# EAGLE design RPi Color Detector LED PCB v2 (EAGLE 9.1.3)
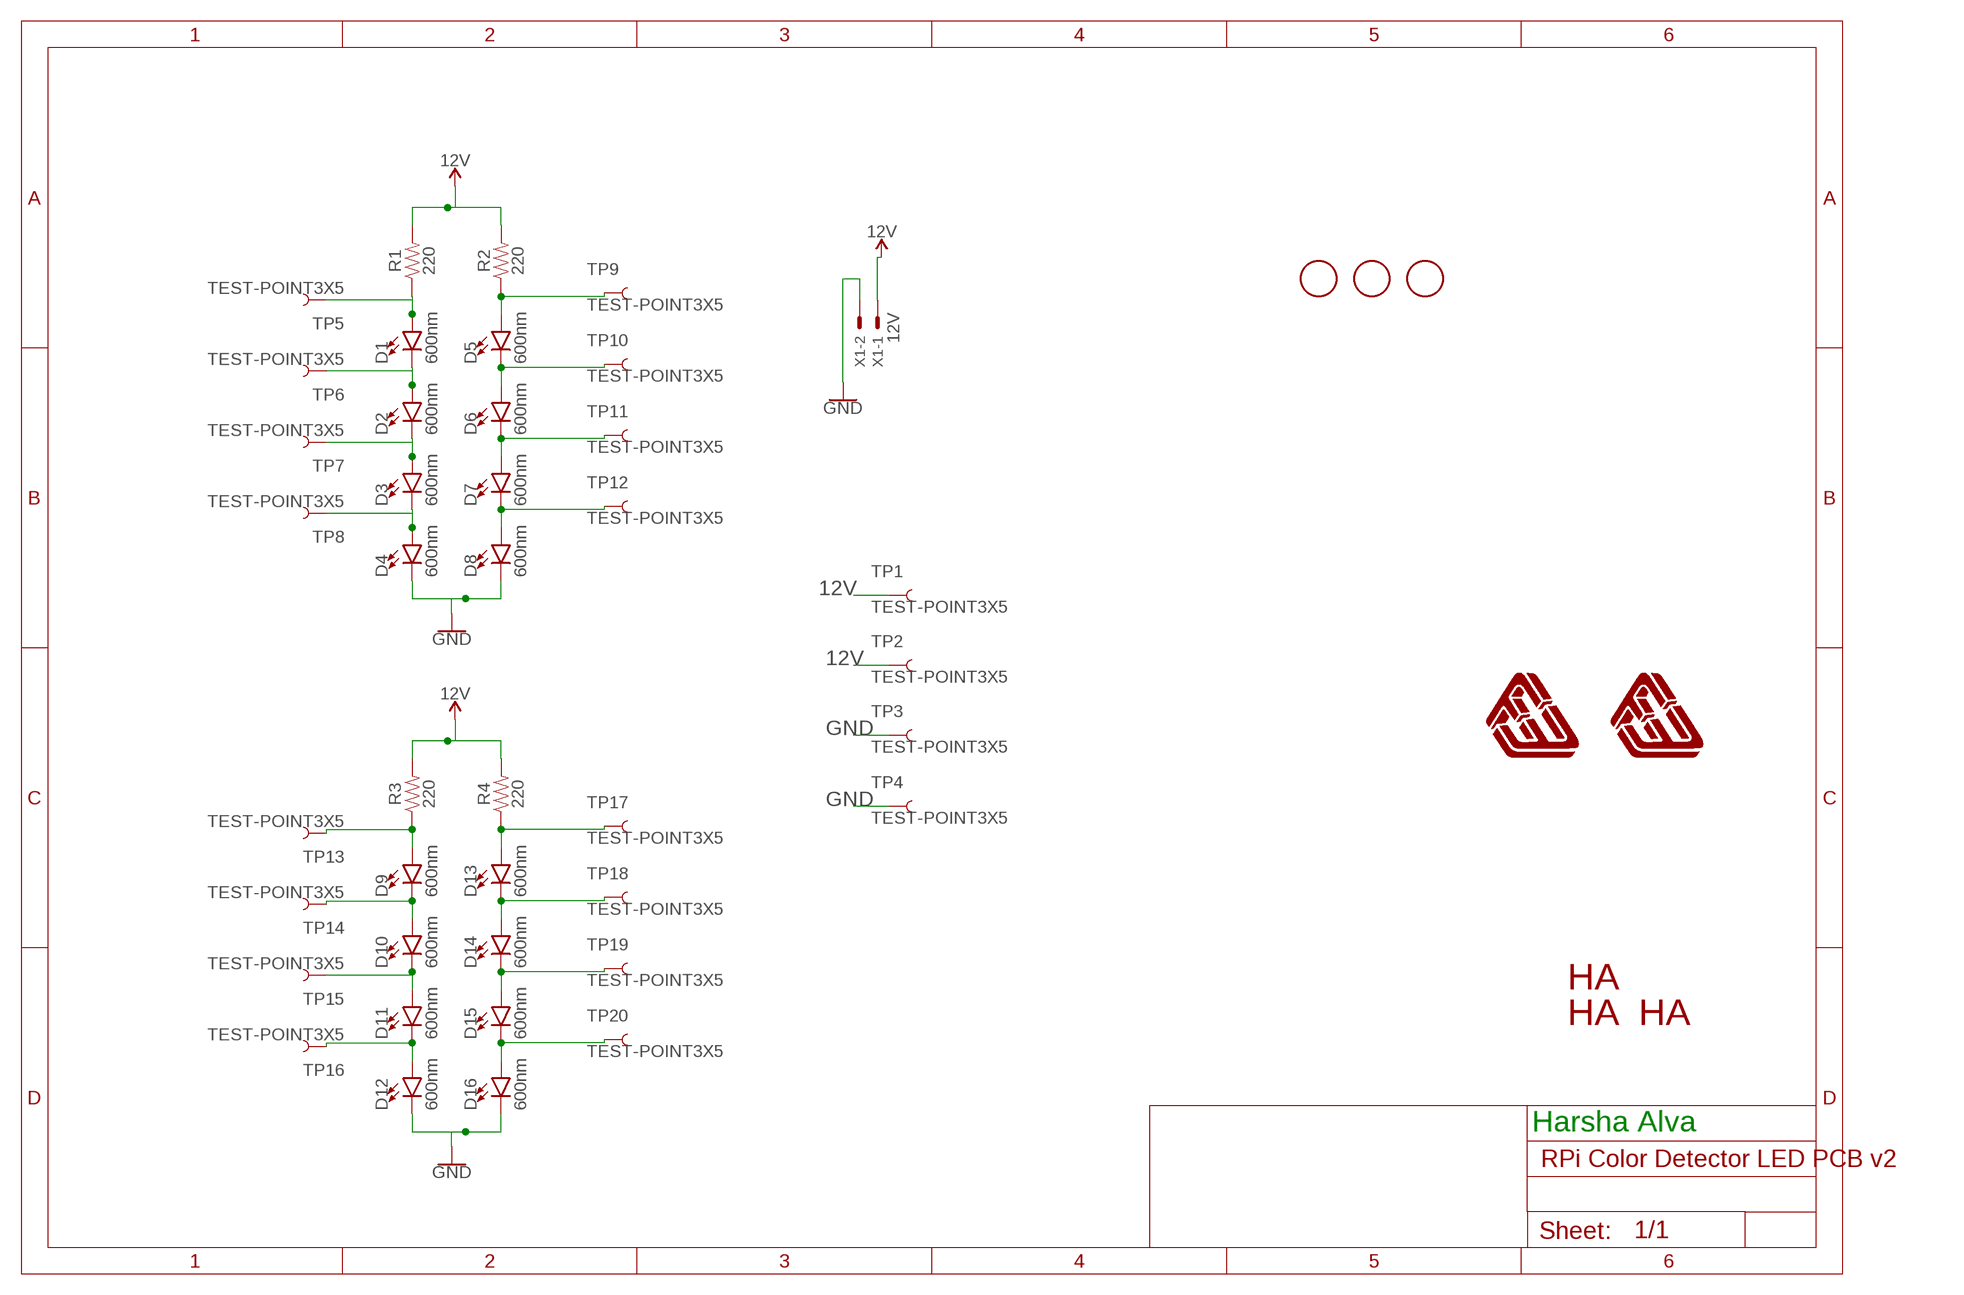
[diagram p0: schematic, sheet 1]

## Parts
D1  600nm  LED-GREEN0603  [LED-0603]
D2  600nm  LED-GREEN0603  [LED-0603]
D3  600nm  LED-GREEN0603  [LED-0603]
D4  600nm  LED-GREEN0603  [LED-0603]
D5  600nm  LED-GREEN0603  [LED-0603]
D6  600nm  LED-GREEN0603  [LED-0603]
D7  600nm  LED-GREEN0603  [LED-0603]
D8  600nm  LED-GREEN0603  [LED-0603]
D9  600nm  LED-GREEN0603  [LED-0603]
D10  600nm  LED-GREEN0603  [LED-0603]
D11  600nm  LED-GREEN0603  [LED-0603]
D12  600nm  LED-GREEN0603  [LED-0603]
D13  600nm  LED-GREEN0603  [LED-0603]
D14  600nm  LED-GREEN0603  [LED-0603]
D15  600nm  LED-GREEN0603  [LED-0603]
D16  600nm  LED-GREEN0603  [LED-0603]
FWLOGO_1  FWLOGO  [FWLOGO]
FWLOGO_2  FWLOGO  [FWLOGO]
M_HA_1  HA_MARK  [HA_MARK]
M_HA_3  HA_MARK  [HA_MARK]
M_HA_4  HA_MARK  [HA_MARK]
R1  220  220OHM-0603-1/10W-1%  [0603]
R2  220  220OHM-0603-1/10W-1%  [0603]
R3  220  220OHM-0603-1/10W-1%  [0603]
R4  220  220OHM-0603-1/10W-1%  [0603]
TP1  TEST-POINT3X5  [PAD.03X.05]
TP2  TEST-POINT3X5  [PAD.03X.05]
TP3  TEST-POINT3X5  [PAD.03X.05]
TP4  TEST-POINT3X5  [PAD.03X.05]
TP5  TEST-POINT3X5  [PAD.03X.05]
TP6  TEST-POINT3X5  [PAD.03X.05]
TP7  TEST-POINT3X5  [PAD.03X.05]
TP8  TEST-POINT3X5  [PAD.03X.05]
TP9  TEST-POINT3X5  [PAD.03X.05]
TP10  TEST-POINT3X5  [PAD.03X.05]
TP11  TEST-POINT3X5  [PAD.03X.05]
TP12  TEST-POINT3X5  [PAD.03X.05]
TP13  TEST-POINT3X5  [PAD.03X.05]
TP14  TEST-POINT3X5  [PAD.03X.05]
TP15  TEST-POINT3X5  [PAD.03X.05]
TP16  TEST-POINT3X5  [PAD.03X.05]
TP17  TEST-POINT3X5  [PAD.03X.05]
TP18  TEST-POINT3X5  [PAD.03X.05]
TP19  TEST-POINT3X5  [PAD.03X.05]
TP20  TEST-POINT3X5  [PAD.03X.05]
U$1  FIDUCIAL  [FIDUCIAL_1MM]
U$2  FIDUCIAL  [FIDUCIAL_1MM]
U$3  FIDUCIAL  [FIDUCIAL_1MM]
X1  12V  JST-XH-02-PIN-LONG-PAD  [JST-XH-02-PACKAGE-LONG-PAD]

## Nets
12V: R1.2 R2.2 R3.2 R4.2 TP1.P$1 TP2.P$1 X1.1
GND: D4.C D8.C D12.C D16.C TP3.P$1 TP4.P$1 X1.2
N$1: D1.A R1.1 TP5.P$1
N$4: D1.C D2.A TP6.P$1
N$5: D2.C D3.A TP7.P$1
N$6: D3.C D4.A TP8.P$1
N$7: D5.A R2.1 TP9.P$1
N$8: D5.C D6.A TP10.P$1
N$9: D6.C D7.A TP11.P$1
N$10: D7.C D8.A TP12.P$1
N$11: D9.A R3.1 TP13.P$1
N$12: D9.C D10.A TP14.P$1
N$13: D10.C D11.A TP15.P$1
N$14: D11.C D12.A TP16.P$1
N$15: D13.A R4.1 TP17.P$1
N$16: D13.C D14.A TP18.P$1
N$17: D14.C D15.A TP19.P$1
N$18: D15.C D16.A TP20.P$1

## Notes on the sheet
- Harsha Alva

## Library data of the parts
D1-D16 = SparkFun-LED:LED-GREEN: Green SMD LED Used in manufacturing of various products at SparkFun Packages: 0603 - SMD 0603 package [Product Link] <http://www.futureelectronics.com/en/technologies/semiconductors/optoelectronics/leds/Pages/9894312-LTST-C190GKT.aspx?CrossPart=HSMG-C190&IM=0> LilyPad 1206 - SMD1206 LilyPad package [Product Link] <http://www.futureelectronics.com/en/Technologies/Product.aspx?ProductID=IN150NGHARVATEKCORPORATION2049943&IM=0> 1206 - SMD1206 package [Product Link] <http://www.futureelectronics.com/en/technologies/semiconductors/optoelectronics/leds/Pages/8315665-LTST-C150KGKT.aspx?IM=0> 1206 Bottom Mount -SMD 1206 Bottom Mount [Product Link] <http://www.digikey.com/product-detail/en/lite-on-inc/LTST-C230KGKT/160-1456-1-ND/386854> SparkFun Products: Pro Mini 328 -5V <https://www.sparkfun.com/products/821> RedBoard <https://www.sparkfun.com/products/12757> MP3 Trigger <https://www.sparkfun.com/products/13720> Makey Makey <https://www.sparkfun.com/products/11076>; PROD_ID: DIO-00821; VALUE: GREEN
FWLOGO_1 FWLOGO_2 = FracktalWorks:FWLOGO: Fracktal Works Logo without name
M_HA_1 M_HA_3 M_HA_4 = FracktalWorks:HA_MARK: Maker mark
R1-R4 = SparkFun-Resistors:220OHM: 220Ω resistor A resistor is a passive two-terminal electrical component that implements electrical resistance as a circuit element. Resistors act to reduce current flow, and, at the same time, act to lower voltage levels within circuits. - Wikipedia; PROD_ID: RES-07861
TP1-TP20 = SparkFun-Connectors:TEST-POINT: SparkFun Test Points Bare copper test points for troubleshooting or In-Circuit-Testing. These are used by our Production team for verifying production board runs using pogo-pins on test beds. SparkFun Products: SparkFun LSM9DS1 Breakout <https://www.sparkfun.com/products/13284> SparkFun PSOC <https://www.sparkfun.com/products/13714> SparkFun Load Cell Amplifier <https://www.sparkfun.com/products/13879>
U$1-U$3 = adafruit:FIDUCIAL: For use by pick and place machines to calibrate the vision/machine, 1mm By microbuilder.eu
X1 = Rembrandt Electronics - JST XH Connectors v1-0:JST-XH-02-PIN: JST XH Connector 2 Pin Wire to board connector. Pitch: 2,54 mm, (0.100") Number of pins: 2 Created by Rembrandt Electronics www.rembrandtelectronics.com

## Board
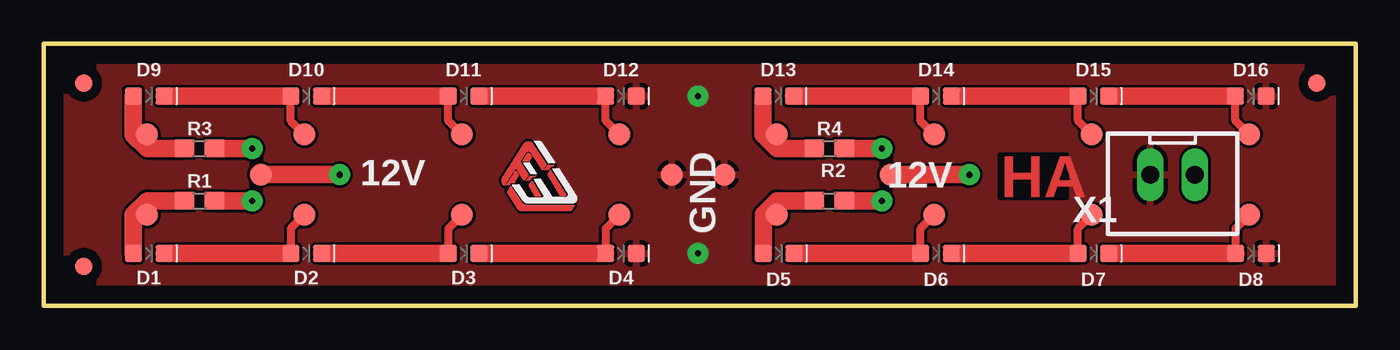
[diagram p1: board, top side]
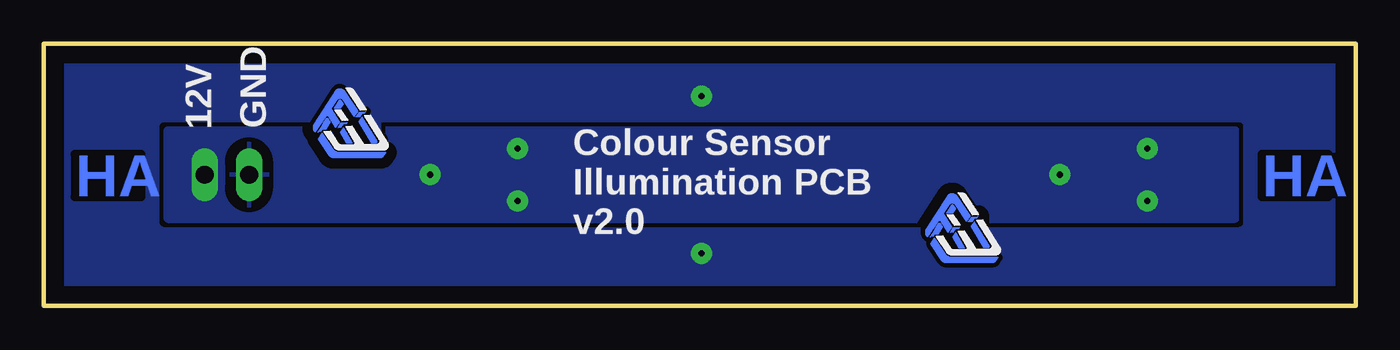
[diagram p2: board, bottom side, seen from below]

Size 75 x 15 mm. Coordinates in mm from the lower left corner, seen from the top.
Outline: 75,15 75,0 0,0 0,15 75,15
Copper layers (1*16): Top 0.035mm / dielectric 1.5mm / Bottom 0.035mm
Design rules "default": minimum track width 6mil, minimum drill 0.35mm, track to track 6mil, track to pad 6mil, pad to pad 6mil, via to via 6mil, smd to smd 6mil, copper to edge 40mil, drill to drill 6mil, minimum pad ring 10mil, minimum via ring 8mil, stop-mask expansion 4mil, vias tented up to drill 0mil, thermal gap 10mil

### Footprints (pad centres in the part's own frame; a part is rotated, then mirrored left to right if it is on the bottom)
LED-0603 = smd 1 x 1: A -0.877,0; C 0.877,0
0603 = smd 1.1 x 1: 1 -0.85,0; 2 0.85,0
PAD.03X.05 = smd 1.27 x 1.27: P$1 0,0
FIDUCIAL_1MM = smd 1 x 1: 1 0,0
JST-XH-02-PACKAGE-LONG-PAD = drill 1.016 long: 1 -1.27,0; 2 1.27,0

### Placement (x,y rotation side)
D1  6,3 0 top
D2  15,3 0 top
D3  24,3 0 top
D4  33,3 0 top
D5  42.01,3 0 top
D6  51,3 0 top
D7  60,3 0 top
D8  69.01,3 0 top
D9  6,12 0 top
D10  15,12 0 top
D11  24,12 0 top
D12  33,12 0 top
D13  41.99,12 0 top
D14  51,12 0 top
D15  60,12 0 top
D16  69,12 0 top
FWLOGO_1  24.68,4.28 0 top
FWLOGO_2  61.1,7.32 0 bottom
FWLOGO_4  FWLOGO  [FWLOGO]  26.1,1.32 0 bottom
FWLOGO_5  FWLOGO  [FWLOGO]  26.1,1.32 0 bottom
M_HA_1  54.7,6.21 0 top
M_HA_3  5.36,6.25 0 bottom
M_HA_4  73.2,6.25 0 bottom
R1  8.91,6 0 top
R2  44.91,6 0 top
R3  8.91,9 0 top
R4  44.91,9 0 top
TP1  12.41,7.5 0 top
TP2  48.41,7.5 0 top
TP3  35.91,7.5 0 top
TP4  38.91,7.5 0 top
TP5  5.91,5.2 0 top
TP6  14.91,5.2 0 top
TP7  23.91,5.2 0 top
TP8  32.91,5.2 0 top
TP9  41.91,5.2 0 top
TP10  50.91,5.2 0 top
TP11  59.91,5.2 0 top
TP12  68.91,5.2 0 top
TP13  5.91,9.8 0 top
TP14  14.91,9.8 0 top
TP15  23.91,9.8 0 top
TP16  32.91,9.8 0 top
TP17  41.91,9.8 0 top
TP18  50.91,9.8 0 top
TP19  59.91,9.8 0 top
TP20  68.91,9.8 0 top
U$1  2.28,12.75 0 top
U$2  2.28,2.25 0 top
U$3  72.78,12.75 0 top
X1  64.53,7.5 180 top

### Tracks (layer width: path | path; a pad name or v marks a point on that pad's centre or on a via)
12V  (via drill 0.35 pad 1.2)
  Top 1: R3.2 v11.91,9 | R1.2 v11.91,6 | TP1.P$1 v16.91,7.5 | R4.2 v47.91,9 | R2.2 v47.91,6 | TP2.P$1 v52.91,7.5
  pour Bottom (isolate 0.61, no thermals): 6.91,10 67.91,10 67.91,5 6.91,5
GND  (via drill 0.35 pad 1.2)
  other vias: 37.41,3 37.41,12
  pour Top: -0.63,15.86 76.3,15.86 76.3,-1.27 -0.63,-1.27
  pour Bottom (isolate 0.254, rank 2): -2.09,17 76.91,17 76.91,-2 -2.09,-2
N$1
  Top 1: D1.A 5.13,5.22 | 5.13,5.22 5.91,6 R1.1 | TP5.P$1 5.89,5.22 5.13,5.22
N$4
  Top 0.457: TP6.P$1 14.12,4.42 D2.A
  Top 1: D1.C D2.A
N$5
  Top 0.457: TP7.P$1 23.12,4.41 D3.A
  Top 1: D2.C D3.A
N$6
  Top 0.457: TP8.P$1 32.12,4.41 D4.A
  Top 1: D3.C D4.A
N$7
  Top 1: D5.A 41.13,5.22 41.91,6 | 41.91,6 R2.1 | TP9.P$1 41.91,6
N$8
  Top 0.457: D6.A 50.13,4.42 TP10.P$1
  Top 1: D5.C D6.A
N$9
  Top 0.457: D7.A 59.12,4.42 TP11.P$1
  Top 1: D6.C D7.A
N$10
  Top 0.457: D8.A 68.13,4.42 TP12.P$1
  Top 1: D7.C D8.A
N$11
  Top 1: D9.A 5.13,9.78 | 5.13,9.78 5.91,9 R3.1 | TP13.P$1 5.89,9.78 5.13,9.78
N$12
  Top 0.457: TP14.P$1 14.12,10.58 D10.A
  Top 1: D9.C D10.A
N$13
  Top 0.457: TP15.P$1 23.12,10.59 D11.A
  Top 1: D10.C D11.A
N$14
  Top 0.457: TP16.P$1 32.12,10.59 D12.A
  Top 1: D11.C D12.A
N$15
  Top 1: D13.A 41.12,9.79 | 41.12,9.79 41.91,9 R4.1 | TP17.P$1 41.12,9.79
N$16
  Top 0.457: TP18.P$1 50.13,10.58 D14.A
  Top 1: D13.C D14.A
N$17
  Top 0.457: TP19.P$1 59.12,10.59 D15.A
  Top 1: D14.C D15.A
N$18
  Top 0.457: TP20.P$1 68.12,10.59 D16.A
  Top 1: D15.C D16.A

### Text on the board
bPlace: Colour Sensor / Illumination PCB / v2.0
tNames: GND | 12V | 12V
bNames: GND | 12V